# Altium schematic sheet Single-Filter.SchDoc
size Letter
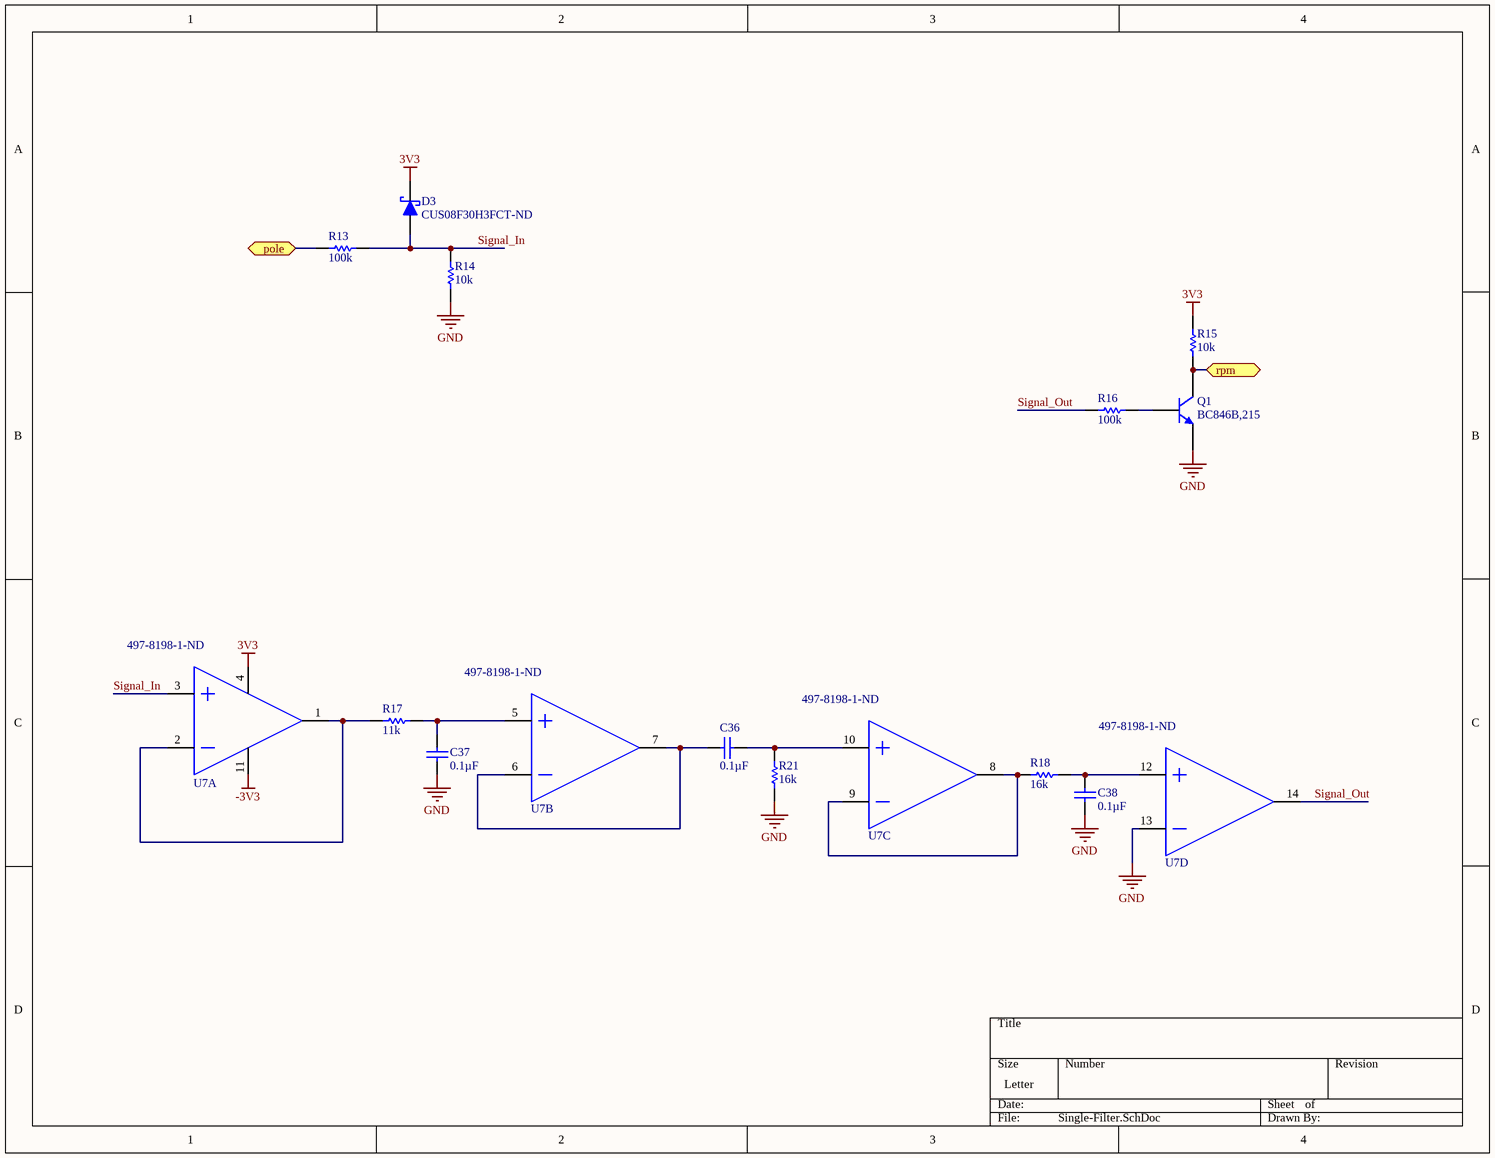
[diagram p0: Single-Filter.SchDoc]

## Parts
C36  Capacitance: 0.1µF  [CAPC1608N(0603")]  (hidden comment: 0.1uF, 50V, 10%, X7R, 1608)
C37  Capacitance: 0.1µF  [CAPC1608N(0603")]  (hidden comment: 0.1uF, 50V, 10%, X7R, 1608)
C38  Capacitance: 0.1µF  [CAPC1608N(0603")]  (hidden comment: 0.1uF, 50V, 10%, X7R, 1608)
D3  CUS08F30H3FCT-ND  [SC-76]
Q1  BC846B,215  [SOT-23]
R13  100k  [RESC1608N(0603")]
R14  10k  [RESC1608N(0603")]
R15  10k  [RESC1608N(0603")]
R16  100k  [RESC1608N(0603")]
R17  11k  [RESC1608N(0603")]
R18  16k  [RESC1608N(0603")]
R21  16k  [RESC1608N(0603")]
U7  Supplier Part Number 1: 497-8198-1-ND  [SOP-14]  (hidden comment: Quad Op Amp TSV324)  (parts A,B,C,D of 4)

## Ports
pole, rpm

## Nets
3V3: D3.K(Cathode) R15.2 U7.4(Vcc+)
-3V3: U7.11(Vcc-)
GND: C37.1(Anode) C38.1(Anode) Q1.2(E) R14.1 R21.1 U7.13(Inverting_Input_3)
pole: R13.2 ; port pole
rpm: Q1.3(C) R15.1 ; port rpm
Signal_In: D3.A(Anode) R13.1 R14.2 U7.3(Non-Inverting_Input_1)
Signal_Out: R16.1 U7.14(Output_4)
NetC36_1: C36.1(Anode) U7.6(Inverting_Input_2) U7.7(Output_2)
NetC36_2: C36.2(Cathode) R21.2 U7.10(Non-Inverting_Input_3)
NetC37_2: C37.2(Cathode) R17.2 U7.5(Non-Inverting_Input_2)
NetC38_2: C38.2(Cathode) R18.1 U7.12(Non-Inverting_Input_4)
NetQ1_1: Q1.1(B) R16.2
NetR17_1: R17.1 U7.1(Output_1) U7.2(Inverting_Input_1)
NetR18_2: R18.2 U7.8(Output_3) U7.9(Inverting_Input_3)

## Library data of the parts
C36-C38 = 0.1uF, 50V, 10%, X7R, 1608: CAP CER 0.1UF 50V 10% X7R 1608 (0603); Manufacturer: Samsung Electro-Mechanics America, Inc; Manufacturer Part Number: CL10B104KB8SFNC; Supplier 1: Digi-Key; RoHS: RoHS Compliant; Category: Capacitors; Stock 1: 743572; Pricing 1: 1=0.12, 10=0.033, 25=0.0232, 100=0.0152, 500=0.01064, 1000=0.00829 (CAD); Packaging: Cut Tape (CT); Tolerance: ±10%; Voltage - Rated: 50V; Temperature Coefficient: X7R; Mounting Type: Surface Mount, MLCC; Operating Temperature: -55°C ~ 125°C; Applications: Boardflex Sensitive; Ratings: -; Package / Case: 0603 (1608 Metric); Size / Dimension: 0.063" L x 0.031" W (1.60mm x 0.80mm); Height - Seated (Max): -; Thickness (Max): 0.035" (0.90mm); Lead Spacing: -; Features: Soft Termination; Lead Style: -; ComponentLink1URL: http://www.samsungsem.com/servlet/FileDownload?type=spec&file=CL10B104KB8SFNC.pdf; ComponentLink1Description: http://www.samsungsem.com/servlet/FileDownload?type=spec&file=CL10B104KB8SFNC.pdf; Supplier Part Number 1: 1276-1936-1-ND
D3 = CUS08F30H3FCT-ND: Diode, Schottky, 30V, 800mA; Created By: Andy Bates; Publisher: AUVic; Date Created: 2016-09-09; Supplier 1: Digi-Key; Supplier Part Number 1: CUS08F30H3FCT-ND
Q1 = BC846B,215: NPN 65V 100mA 250mW; Published: 8-Jun-2000; LatestRevisionDate: 09-Sep-2016; DatasheetVersion: 1997; Publisher: Andy Bates; Supplier 1: Digi-Key; Supplier Part Number 1: 568-1632-1-ND
R13 R16 = 100kR, 1%, 1/10W, 0603 SMD: Made By: Andy Bates; Owned By: AUVic; Created On: 14-06-30; Last Edited: 14-06-30; Value: 100k; Supplier 1: Digi-Key; Supplier Part Number 1: 311-100KGRCT-ND
R14 R15 = 10kR, 1%, 1/10W, 0603 SMD: Made By: Ashwin Sira; Owned By: AUVic; Created On: 14-05-31; Last Edited: 14-05-31; Supplier 1: Digi-Key; Supplier Part Number 1: 311-10.0KHRCT-ND; Value: 10k
R17 = 11kR, 1%, 1/10W, 0603 SMD: Made By: Ashwin Sira; Owned By: AUVic; Created On: 16-01-07; Last Edited: 16-01-07; Value: 11k; Supplier 1: Digi-Key; Supplier Part Number 1: 311-11.0KHRCT-ND
R18 R21 = 16kR, 1%, 1/10W, 0603 SMD: Made By: Ashwin Sira; Owned By: AUVic; Created On: 14-05-31; Last Edited: 14-05-31; Supplier 1: Digi-Key; Value: 16k; Supplier Part Number 1: 311-16.0KHRCT-ND
U7 = Quad Op Amp TSV324: TSV324; LatestRevisionNote: Re-released for DXP Platform.; Publisher: Altium Limited; Created By: Jordan; Creation Date: 10/14/2016; Supplier: Digikey; Supplier Part Number: 497-8198-2-ND; Supplier 1: Digi-Key